# Altium schematic sheet 5_GPIOBanks.SchDoc: GPIO Banks (13-16)
size Legal; Date: 12/27/2025; Author: Praveen Perera; DrawnBy: Praveen Perera; Engineer: Praveen Perera; Revision: 3; SheetNumber: 5; SheetTotal: 9
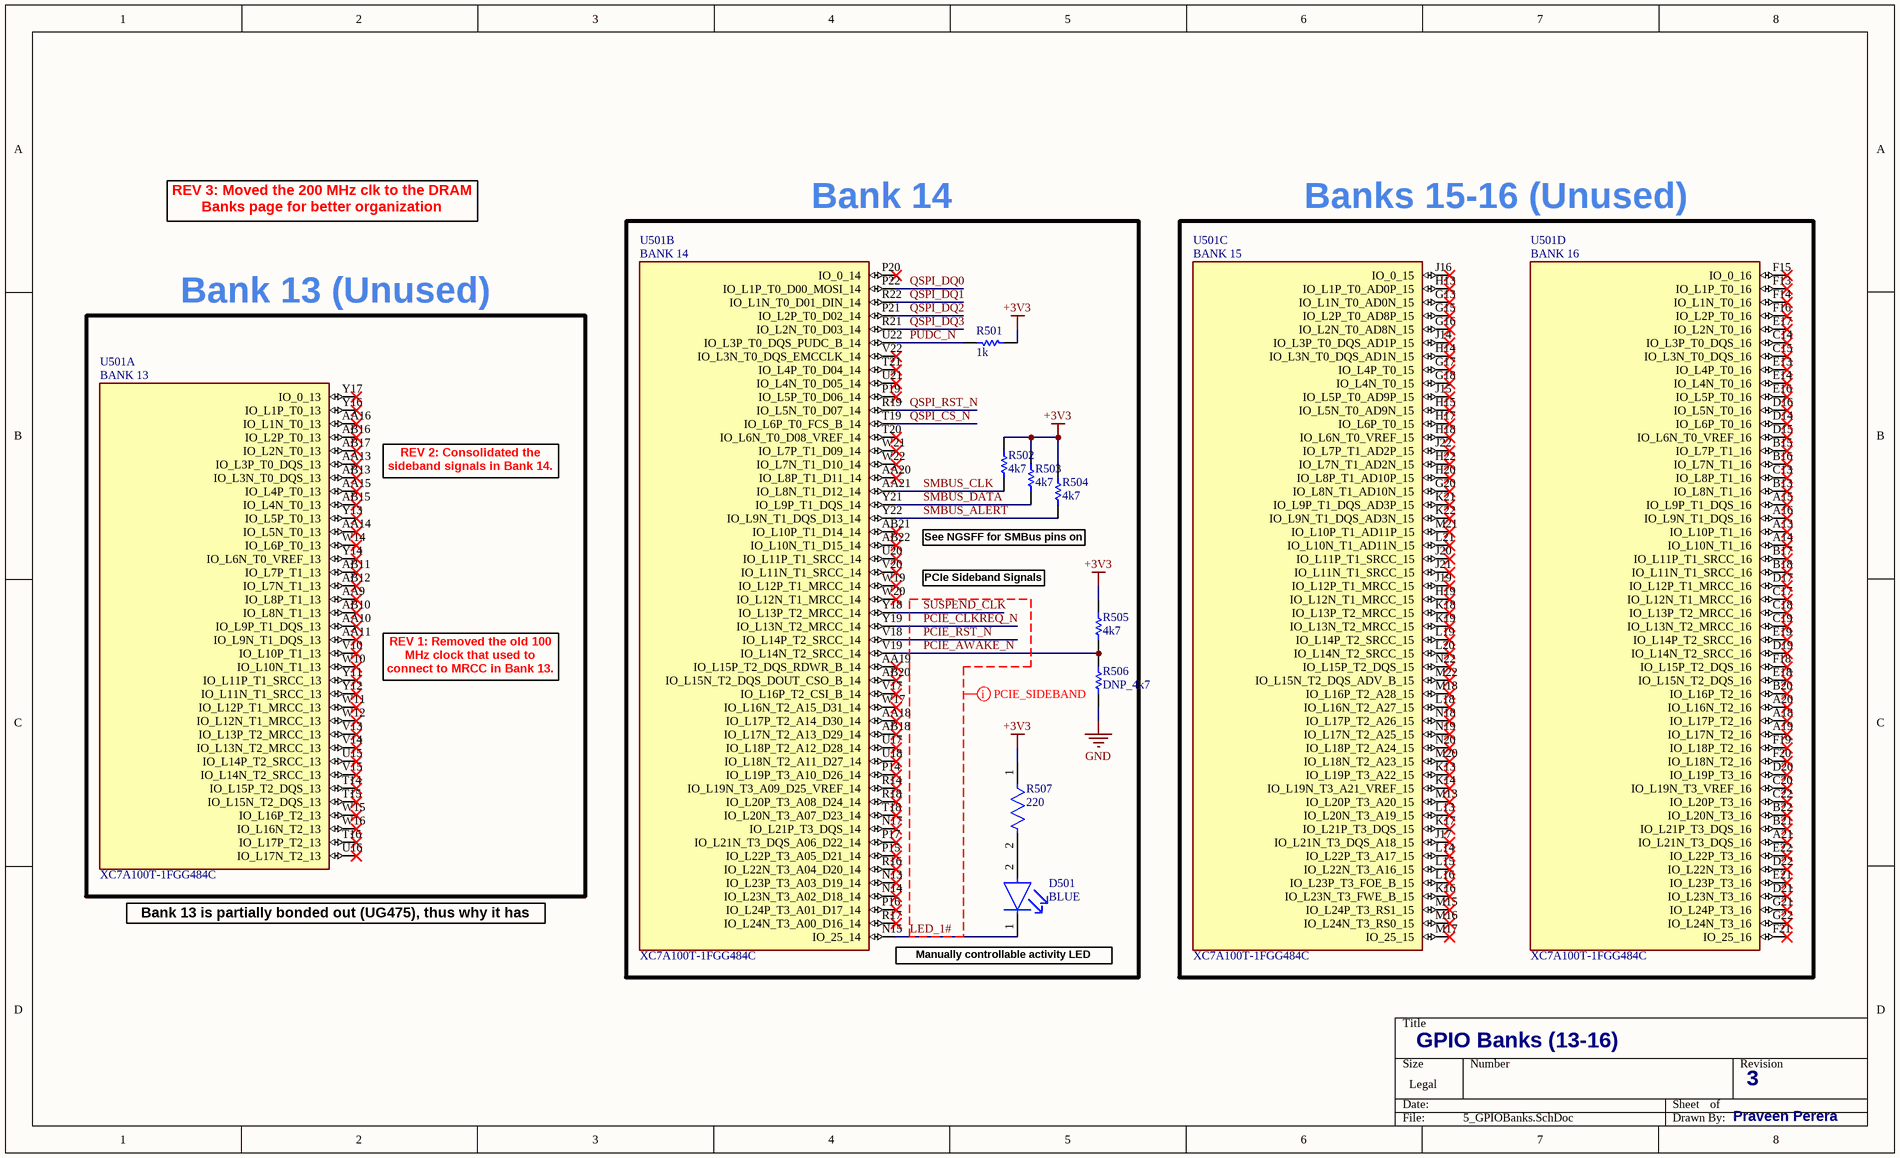
[diagram p0: 5_GPIOBanks.SchDoc]

## Parts
D501  BLUE  [FP-LTST-C193TBKT-5A-MFG]
R501  1k  [RESC0603X28X15ML05T05]
R502  4k7  [RESC0603X28X15NL05T05]
R503  4k7  [RESC0603X28X15NL05T05]
R504  4k7  [RESC0603X28X15NL05T05]
R505  4k7  [RESC0603X28X15NL05T05]
R506  DNP_4k7  [RESC0603X28X15NL05T05]
R507  220  [FP-CR0402-IPC_B]
U501  XC7A100T-1FGG484C  [BGA484C100P22X22_2300X2300X260N]  (parts A,B,C,D of 14)

## Nets
+3V3: R501.1 R502.2 R503.2 R504.2 R505.2 R507.1
GND: R506.1
LED_1#: D501.1(C) U501.N15(IO_25_14)
PCIE_AWAKE_N: R505.1 R506.2 U501.V19(IO_L14N_T2_SRCC_14)
PCIE_CLKREQ_N: U501.Y19(IO_L13N_T2_MRCC_14)
PCIE_RST_N: U501.V18(IO_L14P_T2_SRCC_14)
PUDC_N: R501.2 U501.U22(IO_L3P_T0_DQS_PUDC_B_14)
QSPI_CS_N: U501.T19(IO_L6P_T0_FCS_B_14)
QSPI_DQ0: U501.P22(IO_L1P_T0_D00_MOSI_14)
QSPI_DQ1: U501.R22(IO_L1N_T0_D01_DIN_14)
QSPI_DQ2: U501.P21(IO_L2P_T0_D02_14)
QSPI_DQ3: U501.R21(IO_L2N_T0_D03_14)
QSPI_RST_N: U501.R19(IO_L5N_T0_D07_14)
SMBUS_ALERT: R504.1 U501.Y22(IO_L9N_T1_DQS_D13_14)
SMBUS_CLK: R502.1 U501.AA21(IO_L8N_T1_D12_14)
SMBUS_DATA: R503.1 U501.Y21(IO_L9P_T1_DQS_14)
SUSPEND_CLK: U501.Y18(IO_L13P_T2_MRCC_14)
NetD501_2: D501.2(A) R507.2

Not connected (* = marked no-connect by the designer): U501 A13(IO_L10P_T1_16)* A14(IO_L10N_T1_16)* A15(IO_L9P_T1_DQS_16)* A16(IO_L9N_T1_DQS_16)* A18(IO_L17P_T2_16)* A19(IO_L17N_T2_16)* A20(IO_L16N_T2_16)* A21(IO_L21N_T3_DQS_16)* AA9(IO_L8P_T1_13)* AA10(IO_L9P_T1_DQS_13)* AA11(IO_L9N_T1_DQS_13)* AA13(IO_L3P_T0_DQS_13)* AA14(IO_L5N_T0_13)* AA15(IO_L4P_T0_13)* AA16(IO_L1N_T0_13)* AA18(IO_L17P_T2_A14_D30_14)* AA19(IO_L15P_T2_DQS_RDWR_B_14)* AA20(IO_L8P_T1_D11_14)* AB10(IO_L8N_T1_13)* AB11(IO_L7P_T1_13)* AB12(IO_L7N_T1_13)* AB13(IO_L3N_T0_DQS_13)* AB15(IO_L4N_T0_13)* AB16(IO_L2P_T0_13)* AB17(IO_L2N_T0_13)* AB18(IO_L17N_T2_A13_D29_14)* AB20(IO_L15N_T2_DQS_DOUT_CSO_B_14)* AB21(IO_L10P_T1_D14_14)* AB22(IO_L10N_T1_D15_14)* B13(IO_L8N_T1_16)* B15(IO_L7P_T1_16)* B16(IO_L7N_T1_16)* B17(IO_L11P_T1_SRCC_16)* B18(IO_L11N_T1_SRCC_16)* B20(IO_L16P_T2_16)* B21(IO_L21P_T3_DQS_16)* B22(IO_L20N_T3_16)* C13(IO_L8P_T1_16)* C14(IO_L3P_T0_DQS_16)* C15(IO_L3N_T0_DQS_16)* C17(IO_L12N_T1_MRCC_16)* C18(IO_L13P_T2_MRCC_16)* C19(IO_L13N_T2_MRCC_16)* C20(IO_L19N_T3_VREF_16)* C22(IO_L20P_T3_16)* D14(IO_L6P_T0_16)* D15(IO_L6N_T0_VREF_16)* D16(IO_L5N_T0_16)* D17(IO_L12P_T1_MRCC_16)* D19(IO_L14N_T2_SRCC_16)* D20(IO_L19P_T3_16)* D21(IO_L23N_T3_16)* D22(IO_L22N_T3_16)* E13(IO_L4P_T0_16)* E14(IO_L4N_T0_16)* E16(IO_L5P_T0_16)* E17(IO_L2N_T0_16)* E18(IO_L15N_T2_DQS_16)* E19(IO_L14P_T2_SRCC_16)* E21(IO_L23P_T3_16)* E22(IO_L22P_T3_16)* F13(IO_L1P_T0_16)* F14(IO_L1N_T0_16)* F15(IO_0_16)* F16(IO_L2P_T0_16)* F18(IO_L15P_T2_DQS_16)* F19(IO_L18P_T2_16)* F20(IO_L18N_T2_16)* F21(IO_25_16)* G13(IO_L1N_T0_AD0N_15)* G15(IO_L2P_T0_AD8P_15)* G16(IO_L2N_T0_AD8N_15)* G17(IO_L4P_T0_15)* G18(IO_L4N_T0_15)* G20(IO_L8N_T1_AD10N_15)* G21(IO_L24P_T3_16)* G22(IO_L24N_T3_16)* H13(IO_L1P_T0_AD0P_15)* H14(IO_L3N_T0_DQS_AD1N_15)* H15(IO_L5N_T0_AD9N_15)* H17(IO_L6P_T0_15)* H18(IO_L6N_T0_VREF_15)* H19(IO_L12N_T1_MRCC_15)* H20(IO_L8P_T1_AD10P_15)* H22(IO_L7N_T1_AD2N_15)* J14(IO_L3P_T0_DQS_AD1P_15)* J15(IO_L5P_T0_AD9P_15)* J16(IO_0_15)* J17(IO_L21N_T3_DQS_A18_15)* J19(IO_L12P_T1_MRCC_15)* J20(IO_L11P_T1_SRCC_15)* J21(IO_L11N_T1_SRCC_15)* J22(IO_L7P_T1_AD2P_15)* K13(IO_L19P_T3_A22_15)* K14(IO_L19N_T3_A21_VREF_15)* K16(IO_L23N_T3_FWE_B_15)* K17(IO_L21P_T3_DQS_15)* K18(IO_L13P_T2_MRCC_15)* K19(IO_L13N_T2_MRCC_15)* K21(IO_L9P_T1_DQS_AD3P_15)* K22(IO_L9N_T1_DQS_AD3N_15)* L13(IO_L20N_T3_A19_15)* L14(IO_L22P_T3_A17_15)* L15(IO_L22N_T3_A16_15)* L16(IO_L23P_T3_FOE_B_15)* L18(IO_L16N_T2_A27_15)* L19(IO_L14P_T2_SRCC_15)* L20(IO_L14N_T2_SRCC_15)* L21(IO_L10N_T1_AD11N_15)* M13(IO_L20P_T3_A20_15)* M15(IO_L24P_T3_RS1_15)* M16(IO_L24N_T3_RS0_15)* M17(IO_25_15)* M18(IO_L16P_T2_A28_15)* M20(IO_L18N_T2_A23_15)* M21(IO_L10P_T1_AD11P_15)* M22(IO_L15N_T2_DQS_ADV_B_15)* N13(IO_L23P_T3_A03_D19_14)* N14(IO_L23N_T3_A02_D18_14)* N17(IO_L21P_T3_DQS_14)* N18(IO_L17P_T2_A26_15)* N19(IO_L17N_T2_A25_15)* N20(IO_L18P_T2_A24_15)* N22(IO_L15P_T2_DQS_15)* P14(IO_L19P_T3_A10_D26_14)* P15(IO_L22P_T3_A05_D21_14)* P16(IO_L24P_T3_A01_D17_14)* P17(IO_L21N_T3_DQS_A06_D22_14)* P19(IO_L5P_T0_D06_14)* P20(IO_0_14)* R14(IO_L19N_T3_A09_D25_VREF_14)* R16(IO_L22N_T3_A04_D20_14)* R17(IO_L24N_T3_A00_D16_14)* R18(IO_L20P_T3_A08_D24_14)* T14(IO_L15P_T2_DQS_13)* T15(IO_L15N_T2_DQS_13)* T16(IO_L17P_T2_13)* T18(IO_L20N_T3_A07_D23_14)* T20(IO_L6N_T0_D08_VREF_14)* T21(IO_L4P_T0_D04_14)* U15(IO_L14P_T2_SRCC_13)* U16(IO_L17N_T2_13)* U17(IO_L18P_T2_A12_D28_14)* U18(IO_L18N_T2_A11_D27_14)* U20(IO_L11P_T1_SRCC_14)* U21(IO_L4N_T0_D05_14)* V10(IO_L10P_T1_13)* V13(IO_L13P_T2_MRCC_13)* V14(IO_L13N_T2_MRCC_13)* V15(IO_L14N_T2_SRCC_13)* V17(IO_L16P_T2_CSI_B_14)* V20(IO_L11N_T1_SRCC_14)* V22(IO_L3N_T0_DQS_EMCCLK_14)* W10(IO_L10N_T1_13)* W11(IO_L12P_T1_MRCC_13)* W12(IO_L12N_T1_MRCC_13)* W14(IO_L6P_T0_13)* W15(IO_L16P_T2_13)* W16(IO_L16N_T2_13)* W17(IO_L16N_T2_A15_D31_14)* W19(IO_L12P_T1_MRCC_14)* W20(IO_L12N_T1_MRCC_14)* W21(IO_L7P_T1_D09_14)* W22(IO_L7N_T1_D10_14)* Y11(IO_L11P_T1_SRCC_13)* Y12(IO_L11N_T1_SRCC_13)* Y13(IO_L5P_T0_13)* Y14(IO_L6N_T0_VREF_13)* Y16(IO_L1P_T0_13)* Y17(IO_0_13)*

## Layout directives
mark named PCIE_SIDEBAND: LED_1#, PCIE_AWAKE_N, PCIE_CLKREQ_N, PCIE_RST_N, SUSPEND_CLK

## Notes on the sheet
- REV 3: Moved the 200 MHz clk to the DRAM Banks page for better organization
- Bank 14
- Banks 15-16 (Unused)
- Bank 13 (Unused)
- REV 2: Consolidated the sideband signals in Bank 14.
- See NGSFF for SMBus pins on M.2
- PCIe Sideband Signals
- REV 1: Removed the old 100 MHz clock that used to connect to MRCC in Bank 13.
- (near U501) Bank 13 is partially bonded out (UG475), thus why it has less pins
- Manually controllable activity LED
- (in symbol XC7A100T-1FGG484C, part A) BANK 13
- (in symbol XC7A100T-1FGG484C, part B) BANK 14
- (in symbol XC7A100T-1FGG484C, part C) BANK 15
- (in symbol XC7A100T-1FGG484C, part D) BANK 16

## Library data of the parts
D501 = CMP-2000-06624-2: LTST-C193TBKT-5A / LED BLUE CLEAR CHIP SMD; Number of Elements: 1; Forward Voltage: 2.8V; Forward Current: 20mA; Test Current: 5mA; Lens Color: Colorless; Dominant Wavelength: 475nm; Reverse Voltage: 5V; Viewing Angle: 130°; Lens Style: Diffused; Luminous Intensity: 15mcd; Power Dissipation: 76mW; Max Operating Temperature: 80°C; Length: 1.6mm; Number of LEDs: 1; Case/Package: 0603; Case Code (Metric): 1608; Number of Pins: 2; Radiation Hardening: No; Min Operating Temperature: -20°C; Width: 0.8mm; Packaging: Tape and Reel; Package Quantity: 1; Lead Free: Lead Free; Lens Transparency: Clear; Illumination Color: Blue; Color: Blue; RoHS Compliant: Yes; Mount: Surface Mount; Depth: 0.8mm; Case Code (Imperial): 0603; Height: 0.35mm
R501 = CMP-1010-00074-2: CRCW02011K00JNED; Manufacturer: Vishay Dale; Part Number: CRCW02011K00JNED
R502-R506 = CMP-2004-00672-1: CRCW02014K70FNED; Manufacturer: Vishay Dale; Part Number: CRCW02014K70FNED
R507 = CMP-2002-04925-2: CR0402-FX-2200GLF / Thick Film Chip Resistors 0402 220Ω 0.0625W 1% 100ppm/°C; Voltage Rating: 50V; Power Rating: 62.5mW; Resistance: 220R; Packaging: Tape and Reel; Mount: Surface Mount; Military Standard: Not; Case Code (Metric): 1005; Package Quantity: 10000; Thickness: 356um; Tolerance: 1%; Max Operating Temperature: 125°C; Temperature Coefficient: 100ppm/°C; Case Code (Imperial): 0402; Contact Plating: Tin; Width: 0.5mm; Length: 1mm; Height: 0.35mm; Termination: SMD/SMT; Composition: Thick Film; Min Operating Temperature: -55°C; Case/Package: 0402; Radiation Hardening: No; Depth: 0.5mm
U501 = XC7A100T-1FGG484C: Artix-7 Field Programmable Gate Array (FPGA) IC 285 4976640 101440 484-BBGA; MF: Xilinx Inc.; Value: *; Check_prices: https://www.snapeda.com/parts/XC7A100T-1FGG484C/Xilinx/view-part/?ref=eda; MP: XC7A100T-1FGG484C; SnapEDA_Link: https://www.snapeda.com/parts/XC7A100T-1FGG484C/Xilinx/view-part/?ref=snap; Package: FBGA-484 Xilinx